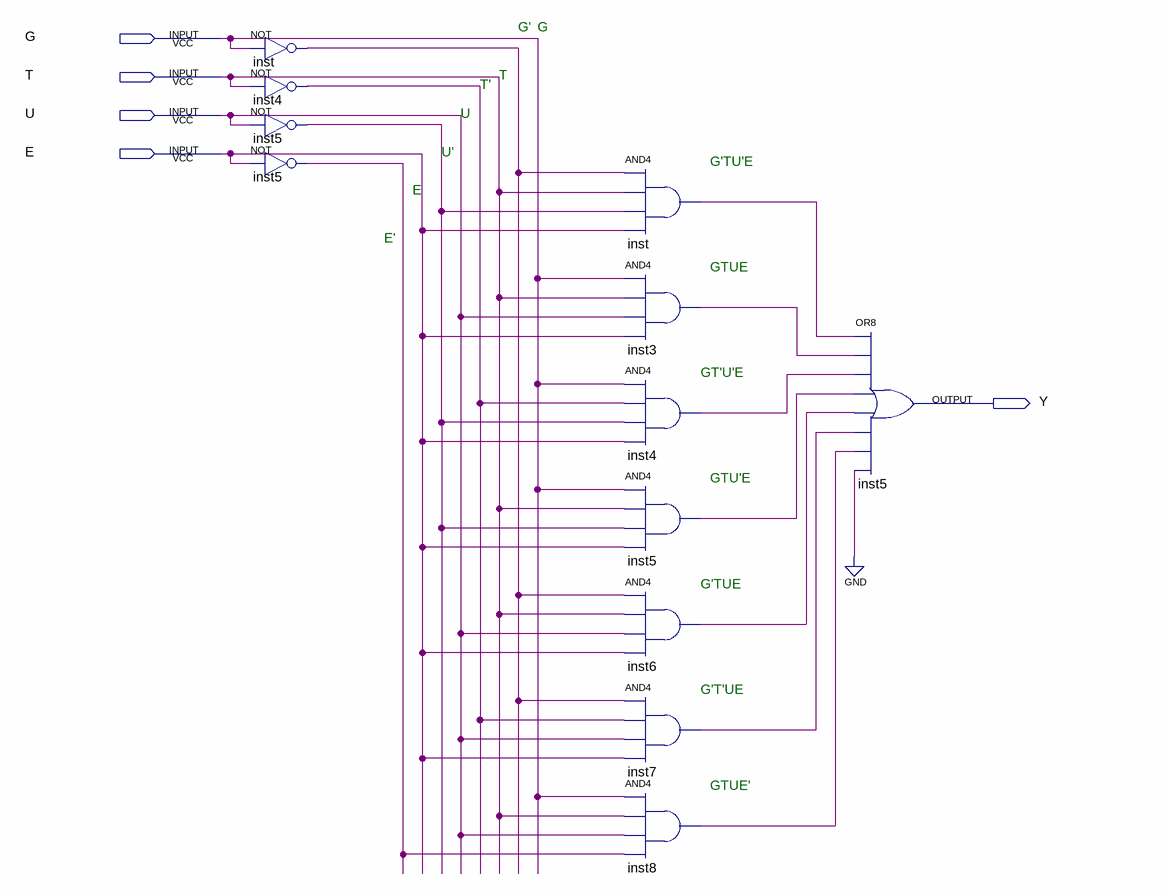
[diagram p0: schematic sheet]
// Quartus schematic lab1_g8_p1.bdf as structural Verilog: 12 symbols, 5 pins
module lab1_g8_p1 (
  input  G,
  input  T,
  input  U,
  input  E,
  output Y
);

  wire inst3_out, inst4_out, inst4_out_2, inst5_out, inst5_out_2, inst5_out_3, inst6_out, inst7_out,
       inst8_out, inst_out, inst_out_2;

  not inst (inst_out, G);
  not inst4 (inst4_out, T);
  not inst5 (inst5_out, U);
  not inst5_dup2 (inst5_out_3, E);
  and inst_dup2 (inst_out_2, inst_out, T, inst5_out, E);
  and inst3 (inst3_out, G, T, U, E);
  and inst4_dup2 (inst4_out_2, G, inst4_out, inst5_out, E);
  and inst5_dup3 (inst5_out_2, G, T, inst5_out, E);
  and inst6 (inst6_out, inst_out, T, U, E);
  and inst7 (inst7_out, inst_out, inst4_out, U, E);
  and inst8 (inst8_out, G, T, U, inst5_out_3);
  or inst5_dup4 (Y, inst_out_2, inst3_out, inst4_out_2, inst5_out_2, inst6_out, inst7_out, inst8_out, 1'b0);

  // Notes on the sheet:
  //   G'
  //   G
  //   T
  //   T'
  //   U
  //   U'
  //   G'TU'E
  //   E
  //   E'
  //   GTUE
  //   GT'U'E
  //   GTU'E
  //   G'TUE
  //   G'T'UE
  //   GTUE'
endmodule
